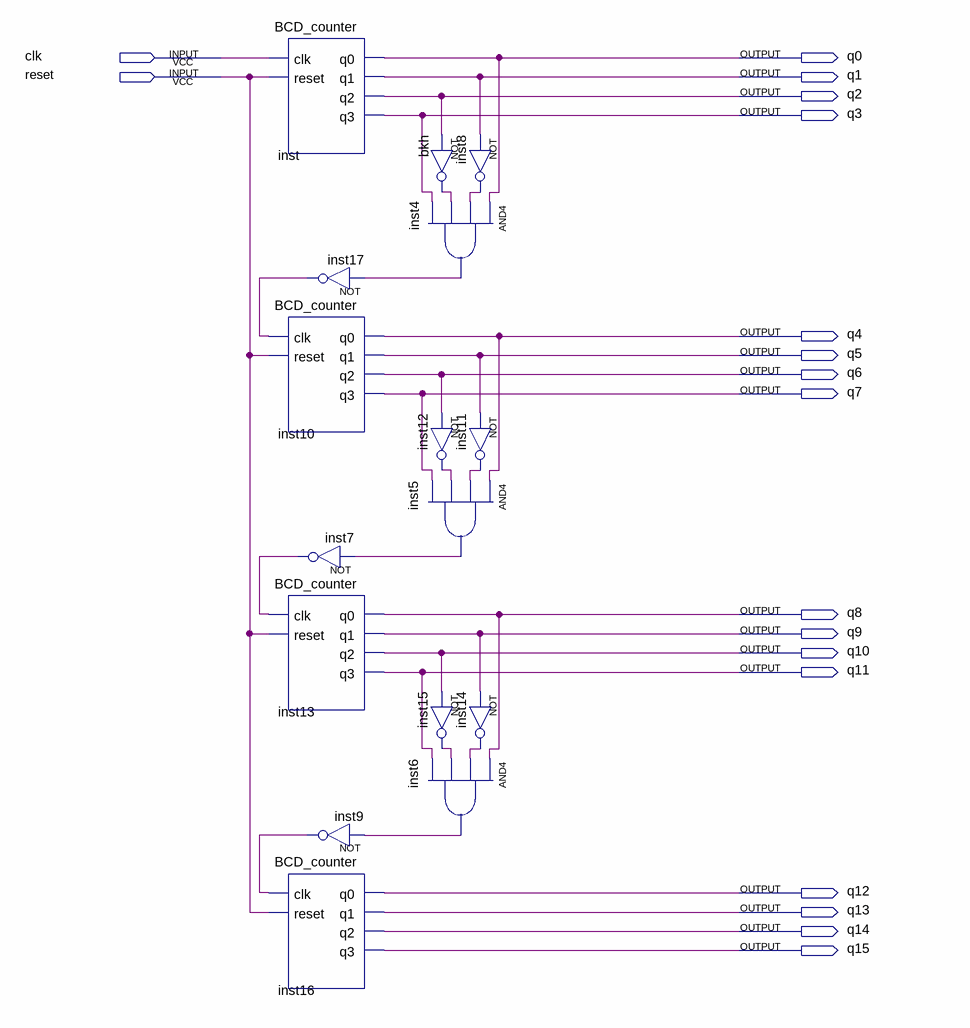
[diagram p0: schematic sheet]
// Quartus schematic BCD_counter16.bdf as structural Verilog: 16 symbols, 18 pins
module BCD_counter16 (
  input  clk,
  input  reset,
  output q0,
  output q1,
  output q2,
  output q3,
  output q4,
  output q5,
  output q6,
  output q7,
  output q8,
  output q9,
  output q10,
  output q11,
  output q12,
  output q13,
  output q14,
  output q15
);

  wire bkh_out, inst4_out, inst5_out, inst6_out, inst7_out, inst8_out, inst9_out, inst11_out, inst12_out,
       inst14_out, inst15_out, inst17_out;

  BCD_counter inst (.clk(clk), .reset(reset), .q0(q0), .q1(q1), .q2(q2), .q3(q3));
  not inst17 (inst17_out, inst4_out);
  BCD_counter inst10 (.clk(inst17_out), .reset(reset), .q0(q4), .q1(q5), .q2(q6), .q3(q7));
  not inst7 (inst7_out, inst5_out);
  BCD_counter inst13 (.clk(inst7_out), .reset(reset), .q0(q8), .q1(q9), .q2(q10), .q3(q11));
  not inst9 (inst9_out, inst6_out);
  BCD_counter inst16 (.clk(inst9_out), .reset(reset), .q0(q12), .q1(q13), .q2(q14), .q3(q15));
  not inst8 (inst8_out, q1);
  not bkh (bkh_out, q2);
  and inst4 (inst4_out, q0, inst8_out, bkh_out, q3);
  not inst11 (inst11_out, q5);
  not inst12 (inst12_out, q6);
  and inst5 (inst5_out, q4, inst11_out, inst12_out, q7);
  not inst14 (inst14_out, q9);
  not inst15 (inst15_out, q10);
  and inst6 (inst6_out, q8, inst14_out, inst15_out, q11);
endmodule
